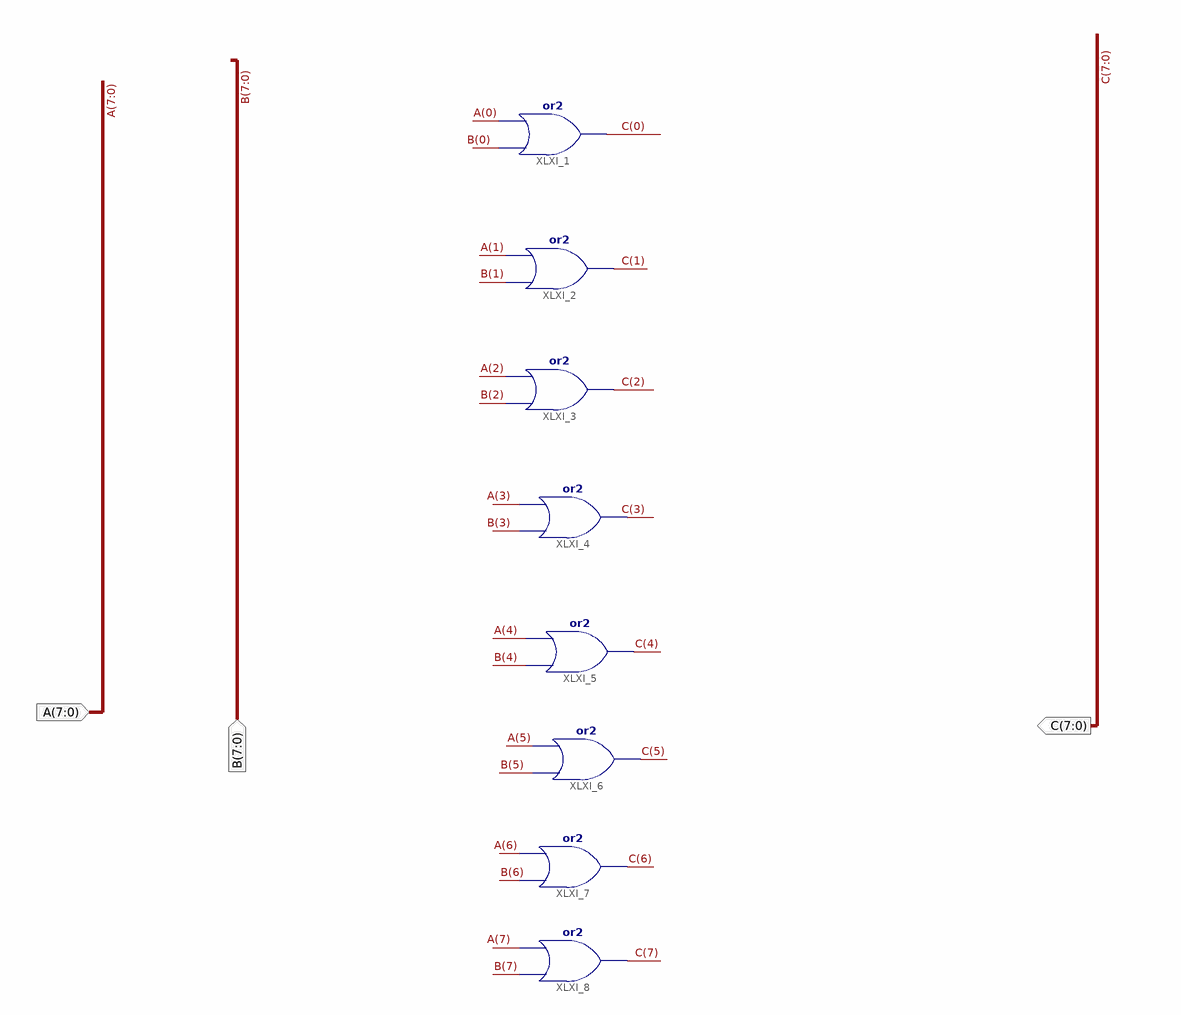
[diagram p0: schematic sheet 1]
// Xilinx ISE schematic or2_8bits.sch (artix7) as structural Verilog: 8 symbols, 3 ports
module or2_8bits (
  input  [7:0] A,
  input  [7:0] B,
  output [7:0] C
);

  or XLXI_1 (C[0], B[0], A[0]);
  or XLXI_2 (C[1], B[1], A[1]);
  or XLXI_3 (C[2], B[2], A[2]);
  or XLXI_4 (C[3], B[3], A[3]);
  or XLXI_5 (C[4], B[4], A[4]);
  or XLXI_6 (C[5], B[5], A[5]);
  or XLXI_7 (C[6], B[6], A[6]);
  or XLXI_8 (C[7], B[7], A[7]);
endmodule
